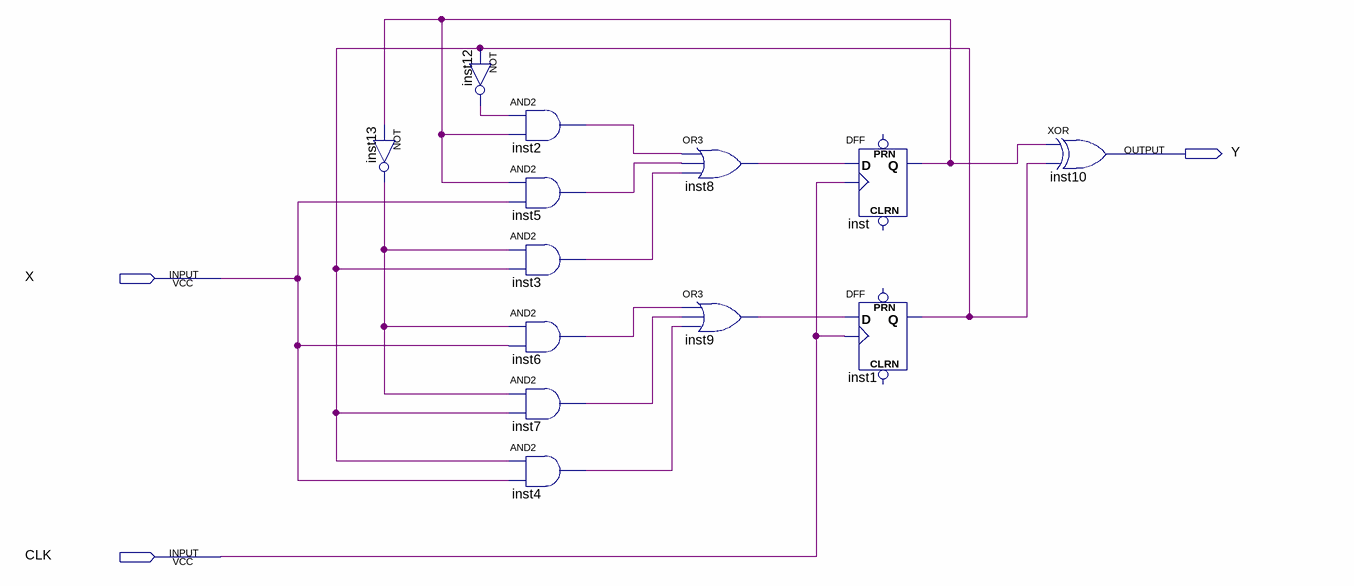
[diagram p0: schematic sheet]
// Quartus schematic btn_Sincrono.bdf as structural Verilog: 13 symbols, 3 pins
module btn_Sincrono (
  input  X,
  input  CLK,
  output Y
);

  wire inst1_q, inst2_out, inst3_out, inst4_out, inst5_out, inst6_out, inst7_out, inst8_out, inst9_out,
       inst12_out, inst13_out, inst_q;

  not inst13 (inst13_out, inst_q);
  not inst12 (inst12_out, inst1_q);
  and inst2 (inst2_out, inst12_out, inst_q);
  and inst5 (inst5_out, inst_q, X);
  and inst3 (inst3_out, inst13_out, inst1_q);
  and inst6 (inst6_out, inst13_out, X);
  and inst7 (inst7_out, inst13_out, inst1_q);
  and inst4 (inst4_out, inst1_q, X);
  or inst8 (inst8_out, inst2_out, inst5_out, inst3_out);
  or inst9 (inst9_out, inst6_out, inst7_out, inst4_out);
  DFF inst (.CLK(CLK), .D(inst8_out), .Q(inst_q));  // open: CLRN, PRN
  DFF inst1 (.CLK(CLK), .D(inst9_out), .Q(inst1_q));  // open: CLRN, PRN
  xor inst10 (Y, inst_q, inst1_q);
endmodule
